# EAGLE design Loginator2368 (EAGLE 6.2)
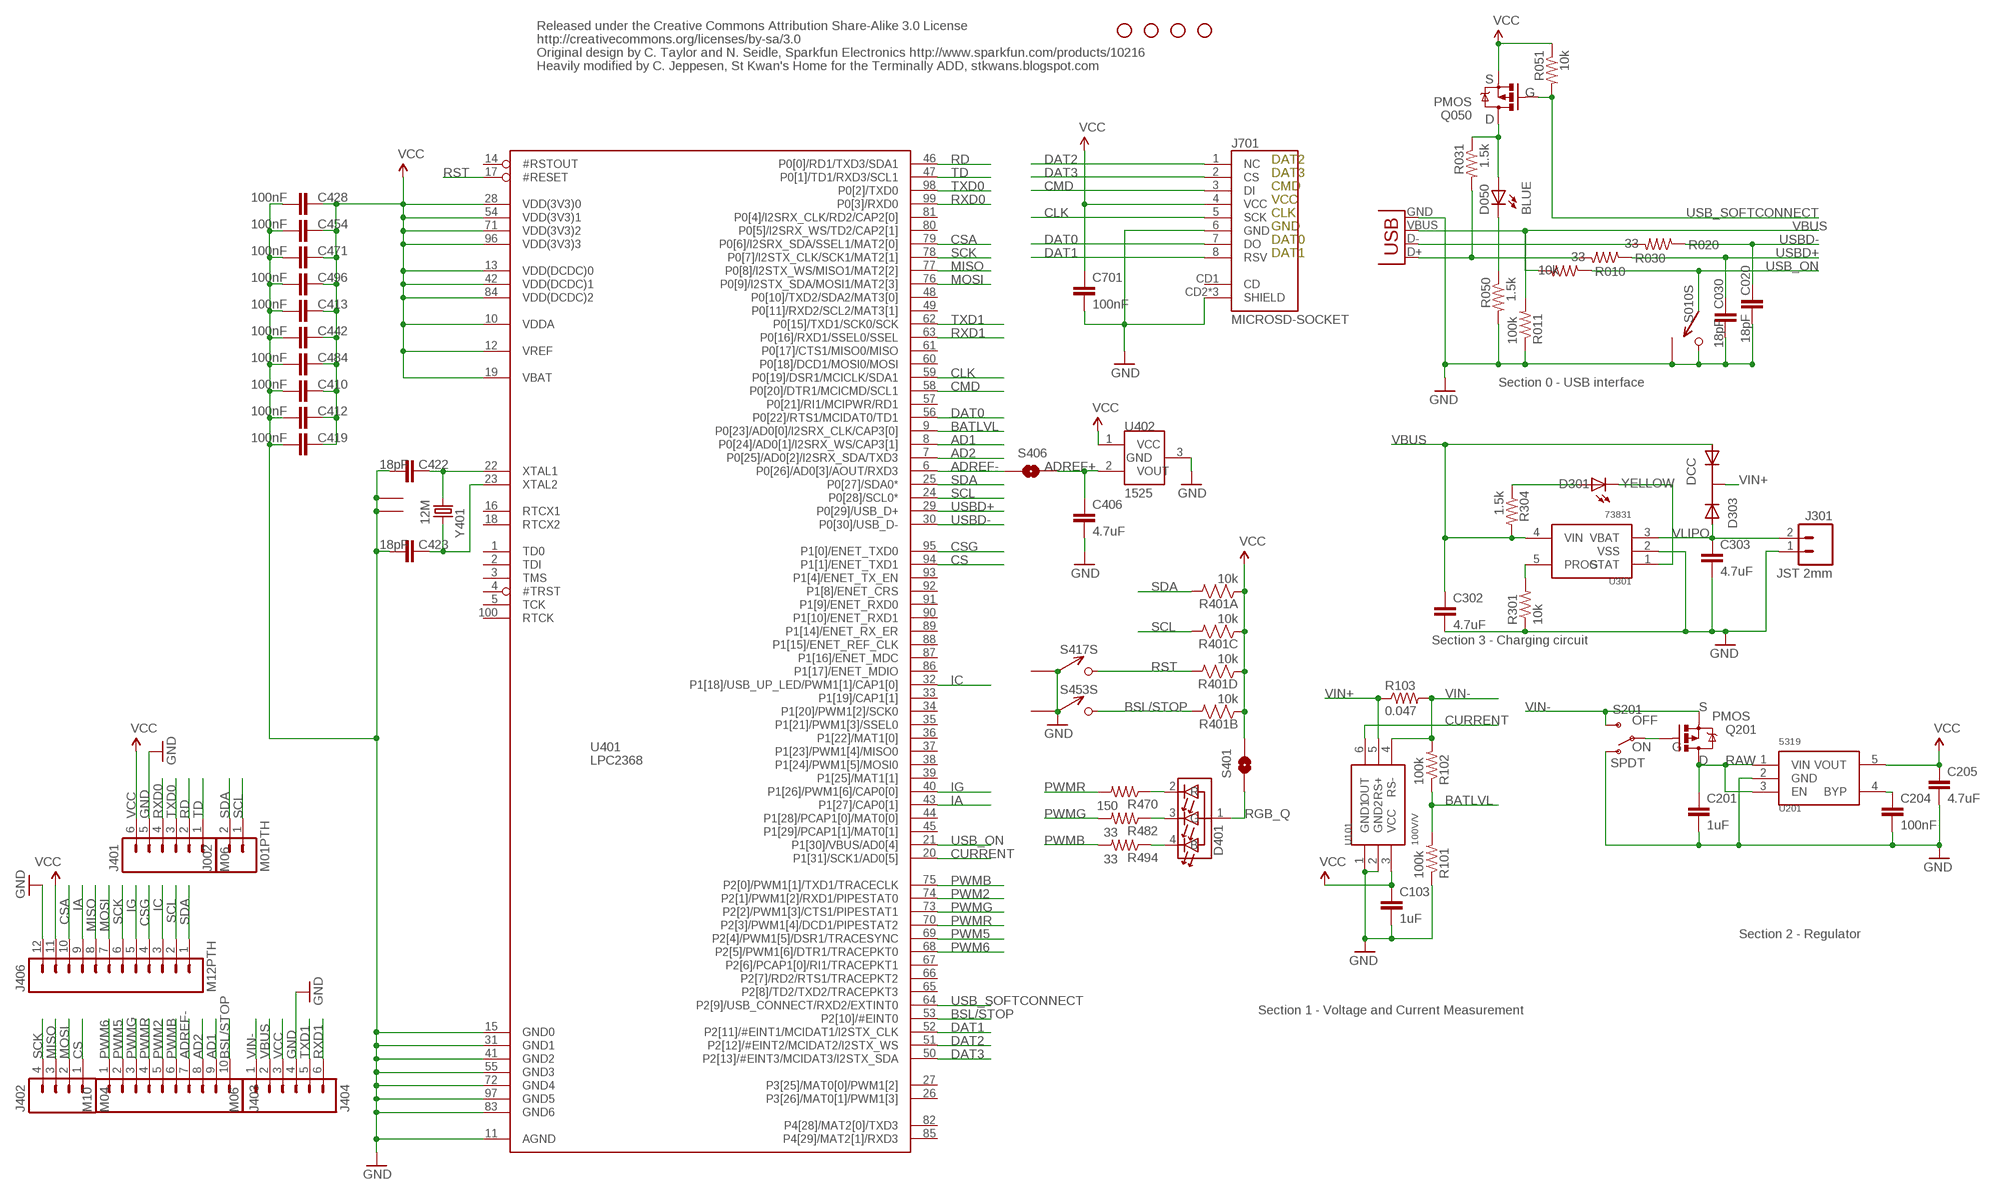
[diagram p0: schematic, sheet 1]

## Parts
C020  18pF  CAP0402-CAP  [0402-CAP]
C030  18pF  CAP0402-CAP  [0402-CAP]
C103  1uF  CAP0402-CAP  [0402-CAP]
C201  1uF  CAP0402-CAP  [0402-CAP]
C204  100nF  CAP0402-CAP  [0402-CAP]
C205  4.7uF  CAP0402-CAP  [0402-CAP]
C302  4.7uF  CAP0402-CAP  [0402-CAP]
C303  4.7uF  CAP0402-CAP  [0402-CAP]
C406  4.7uF  CAP0402-CAP  [0402-CAP]
C410  100nF  CAP0402-CAP  [0402-CAP]
C412  100nF  CAP0402-CAP  [0402-CAP]
C413  100nF  CAP0402-CAP  [0402-CAP]
C419  100nF  CAP0402-CAP  [0402-CAP]
C422  18pF  CAP0402-CAP  [0402-CAP]
C423  18pF  CAP0402-CAP  [0402-CAP]
C428  100nF  CAP0402-CAP  [0402-CAP]
C442  100nF  CAP0402-CAP  [0402-CAP]
C454  100nF  CAP0402-CAP  [0402-CAP]
C471  100nF  CAP0402-CAP  [0402-CAP]
C484  100nF  CAP0402-CAP  [0402-CAP]
C496  100nF  CAP0402-CAP  [0402-CAP]
C701  100nF  CAP0402-CAP  [0402-CAP]
D050  BLUE  LED0603  [LED-0603]
D301  YELLOW  LED0603  [LED-0603]
D303  DCC  PMEG2005CT  [SOT-23-3]
D401  RGB  HSMF-C118  [HSMF-C118]
J001  USBSMD  [USB-MINIB]
J002  M01PTH  M02PTH  [1X02]
J301  JST 2mm  M02-JST-2MM-SMT  [JST-2-SMD]
J401  M06  M06SIP  [1X06]
J402  M04  M04PTH  [1X04]
J403  M10  M10"  [1X10]
J404  M06  M06SIP  [1X06]
J406  M12PTH  [1X12]
J701  MICROSD-SOCKET  [MICROSD-SOCKET-PP]
JP1  STAND-OFF  [STAND-OFF]
JP2  STAND-OFF  [STAND-OFF]
JP3  STAND-OFF  [STAND-OFF]
JP4  STAND-OFF  [STAND-OFF]
Q050  PMOS  MOSFET-PCHANNELSMD  [SOT23-3]
Q201  PMOS  MOSFET-PCHANNELSMD  [SOT23-3]
R010  10k  RESISTOR0402-RES  [0402-RES]
R011  100k  RESISTOR0402-RES  [0402-RES]
R020  33  RESISTOR0402-RES  [0402-RES]
R030  33  RESISTOR0402-RES  [0402-RES]
R031  1.5k  RESISTOR0402-RES  [0402-RES]
R050  1.5k  RESISTOR0402-RES  [0402-RES]
R051  10k  RESISTOR0402-RES  [0402-RES]
R101  100k  RESISTOR0402-RES  [0402-RES]
R102  100k  RESISTOR0402-RES  [0402-RES]
R103  0.047  RESISTOR0402-RES  [0402-RES]
R301  10k  RESISTOR0402-RES  [0402-RES]
R304  1.5k  RESISTOR0402-RES  [0402-RES]
R401  10k  RP404  [CRA04]
R470  150  RESISTOR0402-RES  [0402-RES]
R482  33  RESISTOR0402-RES  [0402-RES]
R494  33  RESISTOR0402-RES  [0402-RES]
S010  SPST  B3U-1100P  [B3U-1100P]
S201  SPDT  SWITCH-SPSTSMD  [AYZ0202]
S401  SOLDERJUMPERNO  [SJ_2S-NO]
S406  SOLDERJUMPERNO  [SJ_2S-NO]
S417  SPST  B3U-1100P  [B3U-1100P]
S453  SPST  B3U-1100P  [B3U-1100P]
U101  100V/V  MAX4173  [SOT-23-6]
U201  5319  MIC5319D5  [SOT-23-5]
U301  73831  MCP73831  [SOT-23-5]
U401  LPC2368  [LQFP100]
U402  1525  MCP1525  [SOT-23-3]
Y401  12M  TSX-3225  [CRYSTAL_SMD]

## Nets
AD1: J403.9 U401.8(P0[24]/AD0[1]/I2SRX_WS/CAP3[1])
AD2: J403.8 U401.7(P0[25]/AD0[2]/I2SRX_SDA/TXD3)
ADREF+: C406.1 S406.1 U402.2(VOUT)
ADREF-: J403.7 S406.2 U401.6(P0[26]/AD0[3]/AOUT/RXD3)
BATLVL: R101.2 R102.1 U401.9(P0[23]/AD0[0]/I2SRX_CLK/CAP3[0])
BSL/STOP: J403.10 R401.7 S453.P$2 U401.53(P2[10]/#EINT0)
CLK: J701.5(SCK) U401.59(P0[19]/DSR1/MCICLK/SDA1)
CMD: J701.3(DI) U401.58(P0[20]/DTR1/MCICMD/SCL1)
CONN_D+: J001.D+ R030.2 R031.2
CONN_D-: J001.D- R020.2
CS: J402.1 U401.94(P1[1]/ENET_TXD1)
CSA: J406.10 U401.79(P0[6]/I2SRX_SDA/SSEL1/MAT2[0])
CSG: J406.4 U401.95(P1[0]/ENET_TXD0)
CURRENT: U101.6(OUT) U401.20(P1[31]/SCK1/AD0[5])
DAT0: J701.7(DO) U401.56(P0[22]/RTS1/MCIDAT0/TD1)
DAT1: J701.8(RSV) U401.52(P2[11]/#EINT1/MCIDAT1/I2STX_CLK)
DAT2: J701.1(NC) U401.51(P2[12]/#EINT2/MCIDAT2/I2STX_WS)
DAT3: J701.2(CS) U401.50(P2[13]/#EINT3/MCIDAT3/I2STX_SDA)
DB: D401.4(B) R494.1
DG: D401.3(G) R482.1
DR: D401.2(R) R470.1
GND: C020.2 C030.2 C103.2 C201.2 C204.2 C205.2 C302.2 C303.2 C406.2 C410.2 C412.2 C413.2 C419.2 C422.1 C423.1 C428.2 C442.2 C454.2 C471.2 C484.2 C496.2 C701.2 J001.GND J301.1 J401.5 J404.4 J406.12 J701.6(GND) J701.CD2(SHIELD) J701.GND1(SHIELD) J701.GND3(SHIELD) R011.1 R050.2 R101.1 R301.1 S010.P$2 S010.P$3 S201.1(O) S417.P$1 S417.P$3 S453.P$1 S453.P$3 U101.1(GND1) U101.2(GND2) U201.2(GND) U301.2(VSS) U401.11(AGND) U401.15(GND0) U401.31(GND1) U401.41(GND2) U401.55(GND3) U401.72(GND4) U401.83(GND6) U401.97(GND5) U402.3(GND) Y401.2 Y401.4
IA: J406.9 U401.43(P1[27]/CAP0[1])
IC: J406.3 U401.32(P1[18]/USB_UP_LED/PWM1[1]/CAP1[0])
IG: J406.5 U401.40(P1[26]/PWM1[6]/CAP0[0])
MISO: J402.3 J406.8 U401.77(P0[8]/I2STX_WS/MISO1/MAT2[2])
MOSI: J402.2 J406.7 U401.76(P0[9]/I2STX_SDA/MOSI1/MAT2[3])
N$1: D301.A R304.1
N$2: R301.2 U301.5(PROG)
N$4: D301.C U301.1(STAT)
N$6: D050.A Q050.3(D) R031.1
N$7: D050.C R050.1
N$10: Q201.1(G) S201.2(P)
N$17: C204.1 U201.4(BYP)
PWM2: J403.5 U401.74(P2[1]/PWM1[2]/RXD1/PIPESTAT0)
PWM5: J403.2 U401.69(P2[4]/PWM1[5]/DSR1/TRACESYNC)
PWM6: J403.1 U401.68(P2[5]/PWM1[6]/DTR1/TRACEPKT0)
PWMB: J403.6 R494.2 U401.75(P2[0]/PWM1[1]/TXD1/TRACECLK)
PWMG: J403.3 R482.2 U401.73(P2[2]/PWM1[3]/CTS1/PIPESTAT1)
PWMR: J403.4 R470.2 U401.70(P2[3]/PWM1[4]/DCD1/PIPESTAT2)
RAW: C201.1 Q201.3(D) U201.1(VIN) U201.3(EN)
RD: J401.2 U401.46(P0[0]/RD1/TXD3/SDA1)
RGB_Q: D401.1(A) S401.1
RST: R401.5 S417.P$2 U401.17(#RESET)
RXD0: J401.4 U401.99(P0[3]/RXD0)
RXD1: J404.6 U401.63(P0[16]/RXD1/SSEL0/SSEL)
SCK: J402.4 J406.6 U401.78(P0[7]/I2STX_CLK/SCK1/MAT2[1])
SCL: J002.1 J406.2 R401.6 U401.24(P0[28]/SCL0*)
SDA: J002.2 J406.1 R401.8 U401.25(P0[27]/SDA0*)
TD: J401.1 U401.47(P0[1]/TD1/RXD3/SCL1)
TXD0: J401.3 U401.98(P0[2]/TXD0)
TXD1: J404.5 U401.62(P0[15]/TXD1/SCK0/SCK)
USB_ON: R010.1 S010.P$1 U401.21(P1[30]/VBUS/AD0[4])
USB_SOFTCONNECT: Q050.1(G) R051.2 U401.64(P2[9]/USB_CONNECT/RXD2/EXTINT0)
USBD+: C030.1 R030.1 U401.29(P0[29]/USB_D+)
USBD-: C020.1 R020.1 U401.30(P0[30]/USB_D-)
VBUS [power]: C302.1 D303.1(A1) J001.VBUS J404.2 R010.2 R011.2 R304.2 U301.4(VIN)
VCC: C103.1 C205.1 C410.1 C412.1 C413.1 C419.1 C428.1 C442.1 C454.1 C471.1 C484.1 C496.1 C701.1 J401.6 J404.3 J406.11 J701.4(VCC) Q050.2(S) R051.1 R401.1 R401.2 R401.3 R401.4 S401.2 U101.3(VCC) U201.5(VOUT) U401.10(VDDA) U401.12(VREF) U401.13(VDD(DCDC)0) U401.19(VBAT) U401.28(VDD(3V3)0) U401.42(VDD(DCDC)1) U401.54(VDD(3V3)1) U401.71(VDD(3V3)2) U401.84(VDD(DCDC)2) U401.96(VDD(3V3)3) U402.1(VCC)
VIN+: D303.3(K) R103.1 U101.5(RS+)
VIN-: J404.1 Q201.2(S) R102.2 R103.2 S201.3(S) U101.4(RS-)
VLIPO [power]: C303.1 D303.2(A2) J301.2 U301.3(VBAT)
XTAL1: C422.2 U401.22(XTAL1) Y401.3
XTAL2: C423.2 U401.23(XTAL2) Y401.1
Unconnected: J701.CD1(CD) U401.1(TD0) U401.2(TDI) U401.3(TMS) U401.4(#TRST) U401.5(TCK) U401.14(#RSTOUT) U401.16(RTCX1) U401.18(RTCX2) U401.26(P3[26]/MAT0[1]/PWM1[3]) U401.27(P3[25]/MAT0[0]/PWM1[2]) U401.33(P1[19]/CAP1[1]) U401.34(P1[20]/PWM1[2]/SCK0) U401.35(P1[21]/PWM1[3]/SSEL0) U401.36(P1[22]/MAT1[0]) U401.37(P1[23]/PWM1[4]/MISO0) U401.38(P1[24]/PWM1[5]/MOSI0) U401.39(P1[25]/MAT1[1]) U401.44(P1[28]/PCAP1[0]/MAT0[0]) U401.45(P1[29]/PCAP1[1]/MAT0[1]) U401.48(P0[10]/TXD2/SDA2/MAT3[0]) U401.49(P0[11]/RXD2/SCL2/MAT3[1]) U401.57(P0[21]/RI1/MCIPWR/RD1) U401.60(P0[18]/DCD1/MOSI0/MOSI) U401.61(P0[17]/CTS1/MISO0/MISO) U401.65(P2[8]/TD2/TXD2/TRACEPKT3) U401.66(P2[7]/RD2/RTS1/TRACEPKT2) U401.67(P2[6]/PCAP1[0]/RI1/TRACEPKT1) U401.80(P0[5]/I2SRX_WS/TD2/CAP2[1]) U401.81(P0[4]/I2SRX_CLK/RD2/CAP2[0]) U401.82(P4[28]/MAT2[0]/TXD3) U401.85(P4[29]/MAT2[1]/RXD3) U401.86(P1[17]/ENET_MDIO) U401.87(P1[16]/ENET_MDC) U401.88(P1[15]/ENET_REF_CLK) U401.89(P1[14]/ENET_RX_ER) U401.90(P1[10]/ENET_RXD1) U401.91(P1[9]/ENET_RXD0) U401.92(P1[8]/ENET_CRS) U401.93(P1[4]/ENET_TX_EN) U401.100(RTCK)

## Notes on the sheet
- Released under the Creative Commons Attribution Share-Alike 3.0 License
- http://creativecommons.org/licenses/by-sa/3.0
- Original design by C. Taylor and N. Seidle, Sparkfun Electronics http://www.sparkfun.com/products/10216
- Heavily modified by C. Jeppesen, St Kwan's Home for the Terminally ADD, stkwans.blogspot.com
- S
- G
- D
- DAT2
- DAT3
- CMD
- VCC
- CLK
- GND
- DAT0
- DAT1
- Section 0 - USB interface
- Section 3 - Charging circuit
- S
- OFF
- ON | G
- D
- Section 2 - Regulator
- Section 1 - Voltage and Current Measurement

## Library data of the parts
C020 C030 C103 C201 C204 C205 C302 C303 C406 C410 C412 C413 C419 C422 C423 C428 C442 C454 C471 C484 C496 C701 = SparkFun:CAP: Capacitor Standard 0603 ceramic capacitor, and 0.1" leaded capacitor.
D050 D301 = SparkFun:LED: LEDs Standard schematic elements and footprints for 5mm, 3mm, 1206, and 0603 sized LEDs. 5mm - Spark Fun Electronics SKU : COM-00529 (and others)
D303 = KwanSystems:PMEG2005CT
D401 = KwanSystems:HSMF-C118
J001 = SparkFun:USB: USB Connectors USB-B-PTH is fully proven SKU : PRT-00139 USB-miniB is fully proven SKU : PRT-00587 USB-A-PCB is untested. USB-A-H is throughly reviewed, but untested. Spark Fun Electronics SKU : PRT-00437 USB-B-SMT is throughly reviewed, but untested. Needs silkscreen touching up. USB-A-S has not been used/tested USB-MB-H has not been used/tested
J002 J301 = SparkFun:M02: Header 2 Standard 2-pin 0.1" header. Use with straight break away headers (SKU : PRT-00116), right angle break away headers (PRT-00553), swiss pins (PRT-00743), machine pins (PRT-00117), and female headers (PRT-00115). Molex polarized connector foot print use with SKU : PRT-08233 with associated crimp pins and housings.
J401 J404 = SparkFun:M06: Header 6 Standard 6-pin 0.1" header. Use with straight break away headers (SKU : PRT-00116), right angle break away headers (PRT-00553), swiss pins (PRT-00743), machine pins (PRT-00117), and female headers (PRT-00115). Molex polarized connector foot print use with SKU : PRT-08094 with associated crimp pins and housings. NOTES ON THE VARIANTS LOCK and LOCK_LONGPADS... This footprint was designed to help hold the alignment of a through-hole component (i.e. 6-pin header) while soldering it into place. You may notice that each hole has been shifted either up or down by 0.005 of an inch from it's more standard position (which is a perfectly straight line). This slight alteration caused the pins (the squares in the middle) to touch the edges of the holes. Because they are alternating, it causes a "brace" to hold the component in place. 0.005 has proven to be the perfect amount of "off-center" position when using our standard breakaway headers. Although looks a little odd when you look at the bare footprint, once you have a header in there, the alteration is very hard to notice. Also, if you push a header all the way into place, it is covered up entirely on the bottom side. This idea of altering the position of holes to aid alignment will be further integrated into the Sparkfun Library for other footprints. It can help hold any component with 3 or more connection pins.
J402 = SparkFun:M04: Header 4 Standard 4-pin 0.1" header. Use with straight break away headers (SKU : PRT-00116), right angle break away headers (PRT-00553), swiss pins (PRT-00743), machine pins (PRT-00117), and female headers (PRT-00115). Molex polarized connector foot print use with SKU : PRT-08231 with associated crimp pins and housings. 1MM SMD Version SKU: PRT-10208
J403 = SparkFun:M10: Header 10 Standard 10-pin 0.1" header. Use with straight break away headers (SKU : PRT-00116), right angle break away headers (PRT-00553), swiss pins (PRT-00743), machine pins (PRT-00117), and female headers (PRT-00115).
J406 = SparkFun:M12: Header 12 Standard 12-pin 0.1" header. Use with straight break away headers (SKU : PRT-00116), right angle break away headers (PRT-00553), swiss pins (PRT-00743), machine pins (PRT-00117), and female headers (PRT-00115).
J701 = KwanSystems:MICROSD-SOCKET: microSD Socket Push-push type uSD socket. Digikey 101-00660-68-6-1-ND. tDoc lines correctly indicate media card edge positions when inserting (unlocked, locked, depressed).
JP1-JP4 = SparkFun:STAND-OFF: Stand Off This is the mechanical footprint for a #4 phillips button head screw. Use the keepout ring to avoid running the screw head into surrounding components. SKU : PRT-00447
Q050 Q201 = SparkFun:MOSFET-PCHANNEL
R010 R011 R020 R030 R031 R050 R051 R101-R103 R301 R304 R470 R482 R494 = SparkFun:RESISTOR: Resistor Basic schematic elements and footprints for 0603, 1206, and PTH resistors.
R401 = KwanSystems:RP4
S010 S417 S453 = KwanSystems:B3U-1100P
S201 = SparkFun:SWITCH-SPST: SPST Switch Simple slide switch. Spark Fun Electronics SKU : COM-00102
S401 S406 = SparkFun:SOLDERJUMPER: Solder Jumper Standard SMD solder jumper. Used to automate production. Two varients : Normally Open and Normally Closed are the same, but have different paste layers. NC will have a large amount of paste and should jumper during reflow.
U101 = KwanSystems:MAX4173
U201 = KwanSystems:MIC5319
U301 = KwanSystems:MCP73831
U401 = KwanSystems:LPC2368
U402 = KwanSystems:MCP1525
Y401 = KwanSystems:TSX-3225

## Net classes
0 default: width 0.152 mm, drill 0.33 mm, clearance 0.152 mm
1 power: width 0.152 mm, drill 0.33 mm, clearance 0.152 mm to class 0, clearance 0.152 mm
2 hv: width 0.152 mm, drill 0.33 mm, clearance 0.152 mm to class 0, clearance 0.152 mm to class 1, clearance 0.152 mm

## Board
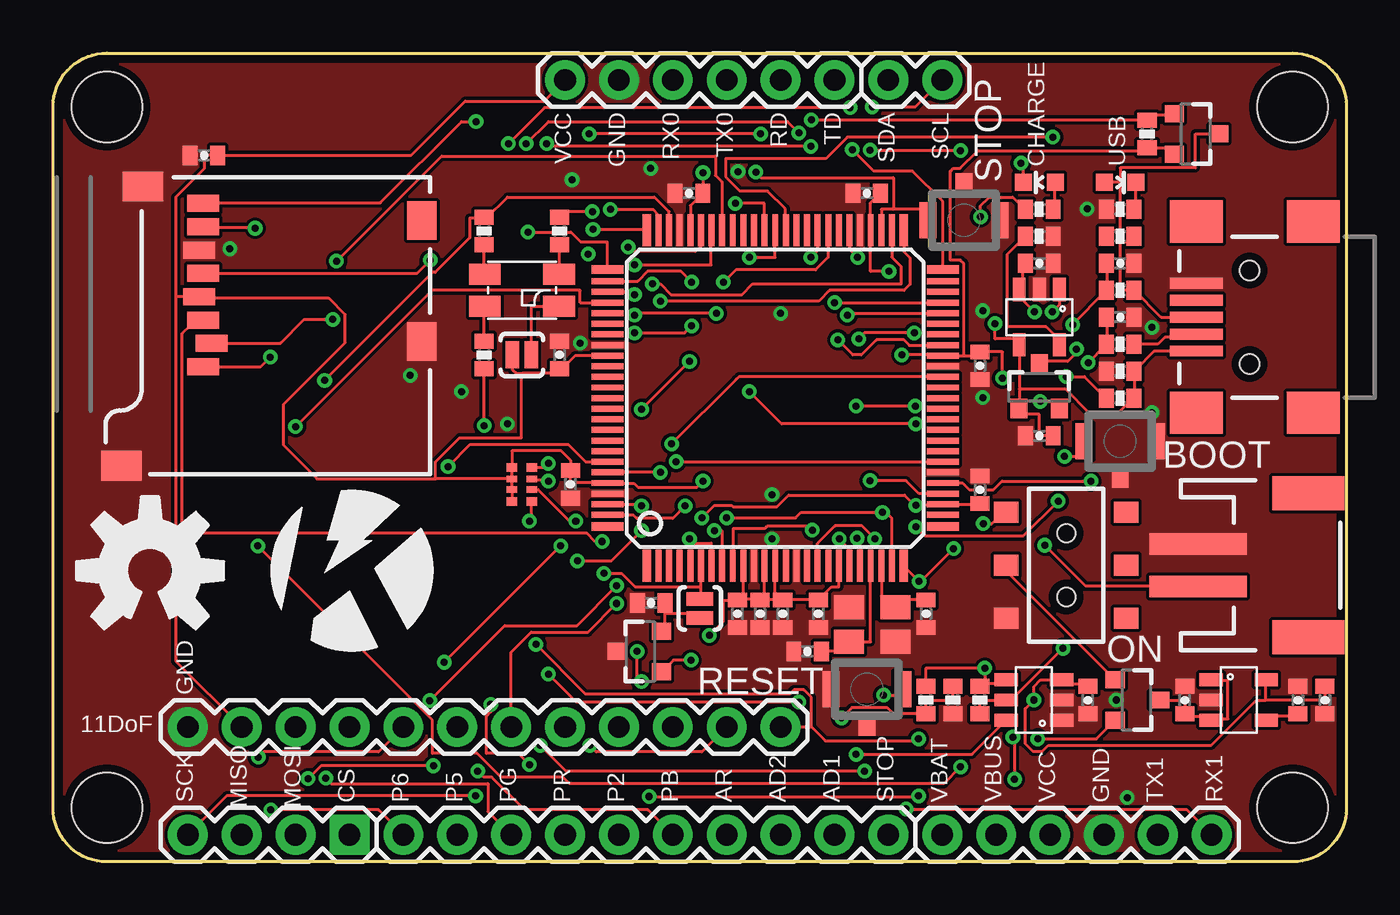
[diagram p1: board, top side]
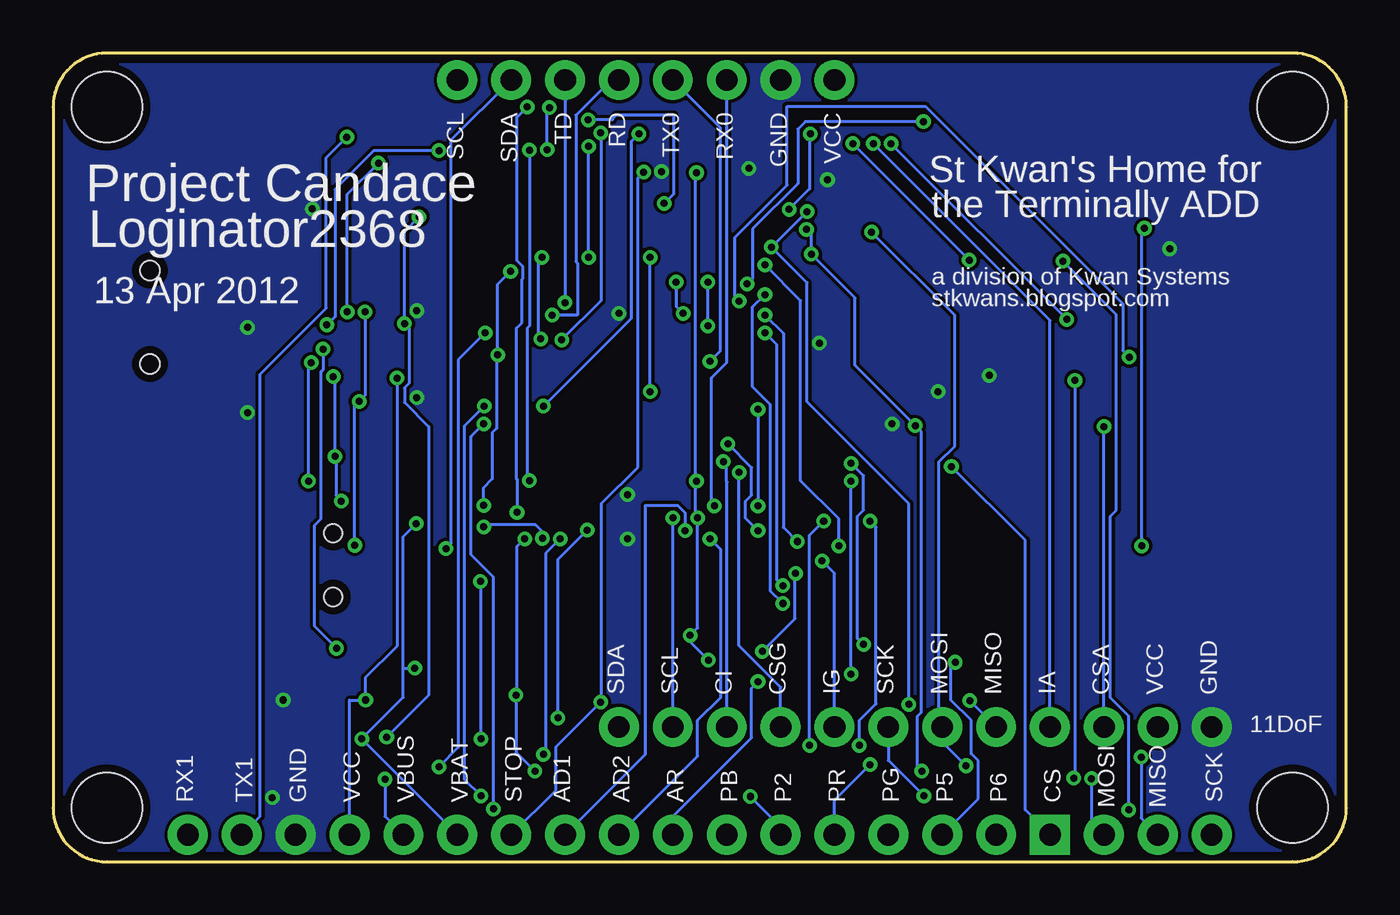
[diagram p2: board, bottom side, seen from below]

Size 60.96 x 38.1 mm. Coordinates in mm from the lower left corner, seen from the top.
Outline: 2.54,38.1 58.42,38.1 arc-90 60.96,35.56 60.96,2.54 arc-90 58.42,0 2.54,0 arc-90 0,2.54 0,35.56 arc-90 2.54,38.1
Copper layers (1*16): Top 0.0356mm / dielectric 1.5011mm / Bottom 0.0356mm
Design rules: minimum track width 6mil, minimum drill 13mil, track to track 6mil, track to pad 6mil, pad to pad 6mil, via to via 6mil, smd to smd 6mil, copper to edge 15mil, drill to drill 6mil, minimum pad ring 7mil, minimum via ring 7mil, stop-mask expansion 4mil, vias tented up to drill 14mil, thermal gap 10mil
vRestrict: area 5.8,2.3 to 6.6,5.1; area 7.1,3.8 to 10.4,4.6; area 9.4,2.8 to 13,3.6; area 13.2,2.8 to 14.5,4.8; area 15.7,2.8 to 17,4.8; area 18.3,2.8 to 19.6,4.8; area 20.8,2.8 to 22.1,4.8; area 23.4,2.8 to 24.6,4.8; area 25.9,2.8 to 27.2,4.8; area 28.4,2.8 to 29.7,4.8; area 31,2.8 to 32.3,4.8; area 33.5,2.8 to 34.8,4.8; 44 more areas

### Footprints (pad centres in the part's own frame; a part is rotated, then mirrored left to right if it is on the bottom)
0402-CAP = smd 0.7 x 0.9: 1 -0.65,0; 2 0.65,0
LED-0603 = smd 0.8 x 0.8: A 0,-0.75; C 0,0.75
SOT-23-3 = smd 0.9 x 0.8: 1 -1,0.95; 2 -1,-0.95; 3 1.1,0
HSMF-C118 = smd 1.5 x 1: 1 1.75,-0.75; 2 1.75,0.75; 3 -1.75,0.75; 4 -1.75,-0.75
USB-MINIB = smd 2.5 x 0.5: D+ 2.5,0; D- 2.5,0.8; GND 2.5,-1.6; ID 2.5,-0.8; VBUS 2.5,1.6 | smd 2.5 x 2: MTN1 -3,4.5; MTN2 2.5,4.5; MTN3 -3,-4.5; MTN4 2.5,-4.5 | hole 0.9: 0,2.2; 0,-2.2
1X02 = drill 1.016 pad 1.88: 1 0,0; 2 2.54,0
JST-2-SMD = smd 1 x 4.6: 1 -1,-3.7; 2 1,-3.7 | smd 1.6 x 3.4: NC1 -3.4,1.5; NC2 3.4,1.5
1X06 = drill 1.016 pad 1.88: 1 0,0; 2 2.54,0; 3 5.08,0; 4 7.62,0; 5 10.16,0; 6 12.7,0
1X04 = drill 1.016 pad 1.88 square: 1 0,0 | drill 1.016 pad 1.88: 2 2.54,0; 3 5.08,0; 4 7.62,0
1X10 = drill 1.016 pad 1.88: 1 0,0; 2 2.54,0; 3 5.08,0; 4 7.62,0; 5 10.16,0; 6 12.7,0; 7 15.24,0; 8 17.78,0; 9 20.32,0; 10 22.86,0
1X12 = drill 1.016 pad 1.88: 1 0,0; 2 2.54,0; 3 5.08,0; 4 7.62,0; 5 10.16,0; 6 12.7,0; 7 15.24,0; 8 17.78,0; 9 20.32,0; 10 22.86,0; 11 25.4,0; 12 27.94,0
MICROSD-SOCKET-PP = smd 0.8 x 1.5: 1 -8.94,10.7; 2 -7.84,10.3; 3 -6.74,10.7; 4 -5.64,10.9; 5 -4.54,10.7; 6 -3.44,10.9; 7 -2.34,10.7; 8 -1.24,10.7 | smd 1.8 x 1.4: CD1 -2.05,0.4; CD2 -7.75,0.4 | smd 1.4 x 1.9: GND1 -13.6,14.55; GND3 -0.45,13.55
STAND-OFF = hole 3.302: 0,0
SOT23-3 = smd 0.8 x 0.9: 1 -0.95,-1; 2 0.95,-1; 3 0,1.1
0402-RES = smd 0.7 x 0.9: 1 -0.65,0; 2 0.65,0
CRA04 = smd 0.4 x 0.5: 1 -0.8,-0.475; 4 0.8,-0.475; 5 0.8,0.475; 8 -0.8,0.475 | smd 0.3 x 0.5: 2 -0.25,-0.475; 3 0.25,-0.475; 6 0.25,0.475; 7 -0.25,0.475
B3U-1100P = smd 0.8 x 1.7: P$1 -1.7,0; P$2 1.7,0 | smd 0.8 x 1.1: P$3 0,-1.65
AYZ0202 = smd 1 x 1.15: 1 -2.5,2.825; 2 0,2.825; 3 2.5,2.825; 4 -2.5,-2.825; 5 0,-2.825; 6 2.5,-2.825 | hole 0.85: 1.5,0; -1.5,0
SJ_2S-NO = smd 0.635 x 1.27: 1 -0.45,0; 2 0.45,0
SOT-23-6 = smd 0.6 x 1.1: 1 -0.95,-1.3; 2 0,-1.3; 3 0.95,-1.3; 4 0.95,1.3; 5 0,1.3; 6 -0.95,1.3
SOT-23-5 = smd 0.6 x 1.1: 1 -0.95,-1.3; 2 0,-1.3; 3 0.95,-1.3; 4 0.95,1.3; 5 -0.95,1.3
LQFP100 = smd 1.5 x 0.4: 1 -7.9,6.06; 25 -7.9,-6.06; 51 7.9,-6.06; 75 7.9,6.06 | smd 1.5 x 0.28: 2 -7.9,5.5; 3 -7.9,5; 4 -7.9,4.5; 5 -7.9,4; 6 -7.9,3.5; 7 -7.9,3; 8 -7.9,2.5; 9 -7.9,2; 10 -7.9,1.5; 11 -7.9,1; 12 -7.9,0.5; 13 -7.9,0; 14 -7.9,-0.5; 15 -7.9,-1; 16 -7.9,-1.5; 17 -7.9,-2; 18 -7.9,-2.5; 19 -7.9,-3; 20 -7.9,-3.5; 21 -7.9,-4; 22 -7.9,-4.5; 23 -7.9,-5; 24 -7.9,-5.5; 52 7.9,-5.5; 53 7.9,-5; 54 7.9,-4.5; 55 7.9,-4; 56 7.9,-3.5; 57 7.9,-3; 58 7.9,-2.5; 59 7.9,-2; 60 7.9,-1.5; 61 7.9,-1; 62 7.9,-0.5; 63 7.9,0; 64 7.9,0.5; 65 7.9,1; 66 7.9,1.5; 67 7.9,2; 68 7.9,2.5; 69 7.9,3; 70 7.9,3.5; 71 7.9,4; 72 7.9,4.5; 73 7.9,5; 74 7.9,5.5 | smd 0.4 x 1.5: 26 -6.06,-7.9; 50 6.06,-7.9; 76 6.06,7.9; 100 -6.06,7.9 | smd 0.28 x 1.5: 27 -5.5,-7.9; 28 -5,-7.9; 29 -4.5,-7.9; 30 -4,-7.9; 31 -3.5,-7.9; 32 -3,-7.9; 33 -2.5,-7.9; 34 -2,-7.9; 35 -1.5,-7.9; 36 -1,-7.9; 37 -0.5,-7.9; 38 0,-7.9; 39 0.5,-7.9; 40 1,-7.9; 41 1.5,-7.9; 42 2,-7.9; 43 2.5,-7.9; 44 3,-7.9; 45 3.5,-7.9; 46 4,-7.9; 47 4.5,-7.9; 48 5,-7.9; 49 5.5,-7.9; 77 5.5,7.9; 78 5,7.9; 79 4.5,7.9; 80 4,7.9; 81 3.5,7.9; 82 3,7.9; 83 2.5,7.9; 84 2,7.9; 85 1.5,7.9; 86 1,7.9; 87 0.5,7.9; 88 0,7.9; 89 -0.5,7.9; 90 -1,7.9; 91 -1.5,7.9; 92 -2,7.9; 93 -2.5,7.9; 94 -3,7.9; 95 -3.5,7.9; 96 -4,7.9; 97 -4.5,7.9; 98 -5,7.9; 99 -5.5,7.9
CRYSTAL_SMD = smd 1.4 x 1.15: 1 -1.092,-0.813; 2 1.092,-0.813; 3 1.092,0.813; 4 -1.092,0.813

### Placement (x,y rotation side)
C020  50.29,25.65 0 top
C030  50.29,28.19 0 top
C103  48.77,7.62 270 top
C201  53.34,7.62 90 top
C204  58.67,7.62 90 top
C205  59.94,7.62 270 top
C302  46.48,20.07 180 top
C303  46.48,28.19 0 top
C406  28.19,12.19 180 top
C410  32.26,11.68 270 top
C412  33.32,11.68 270 top
C413  34.39,11.68 270 top
C419  36.07,11.68 270 top
C422  35.56,9.91 0 top
C423  41.15,11.68 90 top
C428  43.69,17.53 90 top
C442  43.69,23.37 270 top
C454  38.35,31.5 180 top
C471  29.97,31.5 180 top
C484  23.88,23.88 90 top
C496  24.38,17.78 270 top
C701  7.11,33.27 180 top
D050  50.29,32 270 top
D301  46.48,32 90 top
D303  46.48,22.35 90 top
D401  22.1,26.92 0 top
J001  56.39,25.65 180 top
J002  41.91,36.83 180 top
J301  57.66,13.97 270 top
J401  36.83,36.83 180 top
J402  13.97,1.27 180 top
J403  16.51,1.27 0 top
J404  41.91,1.27 0 top
J406  34.29,6.35 180 top
J701  17.78,32.26 90 top
JP1  2.54,2.54 0 top
JP2  58.42,2.54 0 top
JP3  2.54,35.56 0 top
JP4  58.42,35.56 0 top
Q050  53.85,34.29 270 top
Q201  51.05,7.62 270 top
R010  50.29,21.84 0 top
R011  50.29,23.11 0 top
R020  50.29,24.38 0 top
R030  50.29,26.92 0 top
R031  50.29,29.46 0 top
R050  50.29,30.73 180 top
R051  51.56,34.29 90 top
R101  42.42,7.62 90 top
R102  41.15,7.62 90 top
R103  43.69,7.62 90 top
R301  46.48,29.46 180 top
R304  46.48,30.73 180 top
R401  22.1,17.78 270 top
R470  23.88,29.72 90 top
R482  20.32,29.72 90 top
R494  20.32,23.88 270 top
S010  50.29,19.81 0 top
S201  47.75,13.97 90 top
S401  22.1,23.88 180 top
S406  30.48,11.94 90 top
S417  38.35,8.13 0 top
S453  42.93,30.23 180 top
U101  46.23,7.62 90 top
U201  55.88,7.62 270 top
U301  46.48,25.65 180 top
U401  34.04,21.84 90 top
U402  27.69,9.91 180 top
U$1  [KWAN_CIRCLE]  14.1,13.72 0 top
U$2  [OSHW-LOGO-L]  4.57,13.72 0 top
Y401  38.61,11.18 180 top

### Tracks (layer width: path | path; a pad name or v marks a point on that pad's centre or on a via)
AD1  (via drill 0.33)
  Top 0.152: v31.17,15.6 31.52,15.6 31.52,13.95 U401.8
  Bottom 0.152: v31.17,15.6 31.17,16.43 31.52,16.79 33.05,16.79 33.05,5.05 J403.9
AD2  (via drill 0.33)
  Top 0.152: v30,15.21 30.2,15.01 31.01,15.01 31.01,13.95 U401.7
  Bottom 0.152: v30,15.21 29.49,14.71 29.49,7.75 30.58,6.66 30.58,4.98 J403.8
ADREF+
  Top 0.152: U402.2 28.84,11.01 28.84,11.68 | 28.84,11.68 C406.1 | S406.1 30.28,11.68 28.84,11.68
ADREF-  (via drill 0.33)
  Top 0.152: S406.2 30.54,12.44 30.54,12.95 | 30.54,12.95 U401.6 | 30.54,12.95 27.43,12.95 26.8,13.59 v25.96,13.59 | v27.53,9.91 27.53,8.48 v27.74,8.48
  Bottom 0.152: v25.96,13.59 25.98,13.56 25.98,11.46 v27.53,9.91 | v27.74,8.48 28.04,8.18 28.04,5.84 31.75,2.13 J403.7
BATLVL  (via drill 0.33)
  Top 0.152: R101.2 42.42,7.62 41.15,7.62 R102.1 39.61,6.97 39.32,7.26 37.64,7.26 v37.16,6.78 | v35.79,15.62 35.61,15.8 33.66,15.8 33.55,15.7 32.05,15.7 32.05,13.95 U401.9
  Bottom 0.152: v35.79,15.62 37.16,14.25 v37.16,6.78
BSL/STOP  (via drill 0.33)
  Top 0.152: 39.6,30.73 41.23,30.73 S453.P$2 | 39.6,30.73 39.04,30.73 39.04,29.77 U401.53 | v23.34,8.84 24.66,7.52 v35.15,7.52 | R401.7 22.58,18.01 23.27,18.01 v23.34,17.93 | 39.6,30.73 39.6,32.23 33.38,32.23 v33.12,32.49
  Bottom 0.152: v23.34,8.84 v23.34,17.93 | J403.10 37.26,3.38 37.26,5.41 v35.15,7.52 35.1,7.57 35.1,16.89 33.4,18.59 33.4,32.21 v33.12,32.49
CLK  (via drill 0.33)
  Top 0.152: v17.78,28.35 17.14,27.71 J701.5 | v23.27,33.83 23.39,33.71 v35.71,33.71 | v35.71,28.47 36.02,28.78 36.02,29.74 U401.59
  Bottom 0.152: v23.27,33.83 v17.78,28.35 | v35.71,28.47 v35.71,33.71
CMD  (via drill 0.33)
  Top 0.152: v25.88,15.09 25.55,15.09 25.17,15.47 6.1,15.47 6.1,24.89 6.48,25.27 6.83,25.27 J701.3 7.06,25.5 | v27.41,25.76 27.48,25.83 v31.27,25.83 | v31.6,27.3 32.18,27.89 35.94,27.89 36.52,28.47 36.52,29.74 U401.58
  Bottom 0.152: v25.88,15.09 26.54,15.75 26.54,24.89 v27.41,25.76 | v31.27,25.83 31.6,26.16 v31.6,27.3
CONN_D+
  Top 0.152: 53.87,25.65 J001.D+ 52.22,25.65 50.95,26.92 R030.2 50.29,26.92 50.29,29.21 50.93,29.21 50.93,29.46 R031.2 50.95,29.46
CONN_D-
  Top 0.152: 50.95,24.38 R020.2 52.07,24.38 52.4,24.71 53.75,24.71 53.87,24.84 J001.D-
CS  (via drill 0.33)
  Top 0.152: v18.62,18.62 19.66,19.66 24.28,19.66 25.1,18.84 U401.94 26.11,18.85
  Bottom 0.152: v18.62,18.62 15.14,15.14 15.14,2.44 J402.1
CSA  (via drill 0.33)
  Top 0.152: v11.43,20.5 17.86,26.92 24.84,26.92 24.84,26.34 U401.79 26.11,26.34
  Bottom 0.152: J406.10 v11.43,20.5
CSG  (via drill 0.33)
  Top 0.152: v28.63,18.34 U401.95
  Bottom 0.152: v28.63,18.34 28.63,10.19 26.67,8.23 J406.4
CURRENT  (via drill 0.33)
  Top 0.152: v37.85,5.05 43.31,5.05 44.91,6.66 U101.6 | v37.06,15.21 37.52,14.76 37.52,13.95 U401.20
  Bottom 0.152: v37.85,5.05 37.74,5.16 37.74,14.53 v37.06,15.21
DAT0  (via drill 0.33)
  Top 0.152: v9.65,14.88 17.88,6.66 17.88,5.11 19.99,5.11 21.11,3.99 24.03,3.99 24.33,3.68 41.99,3.68 v42.77,4.47 | v37.92,28.47 37.54,28.85 U401.56 | J701.7 7.09,29.9 9.47,29.9 v9.53,29.84 | v40.59,24.92 38.25,24.92 v37.97,24.64
  Bottom 0.152: v9.65,14.88 9.65,29.72 v9.53,29.84 | v42.77,4.47 41.86,5.38 41.86,23.65 v40.59,24.92 | 37.97,28.42 v37.92,28.47 38.1,28.45 38.1,24.64 v37.97,24.64
DAT1  (via drill 0.33)
  Top 0.152: v28.25,27.23 28.63,27.23 29.13,26.72 32.46,26.72 32.97,27.23 39.98,27.23 39.98,28.04 39.54,28.48 U401.52 | J701.8 7.09,31.04 15.42,31.04 19.25,34.87 v19.94,34.87
  Bottom 0.152: v28.25,27.23 27.99,27.48 27.99,29.82 25.86,31.95 25.86,34.52 25.5,34.87 v19.94,34.87
DAT2  (via drill 0.33)
  Top 0.152: v28.63,26.42 36.09,26.42 36.6,26.92 40.11,26.92 40.39,27.2 40.39,28.45 40.11,28.73 U401.51 | 7.09,23.34 J701.1 9.78,23.32 v10.24,23.77
  Bottom 0.152: v10.24,23.77 10.54,24.08 10.54,26.29 19.84,35.59 26.36,35.59 26.36,31.88 28.83,29.41 28.83,26.62 v28.63,26.42
DAT3  (via drill 0.33)
  Top 0.152: v21.46,33.83 23.16,35.53 v37.57,35.53 | v37.67,33.55 38.68,32.54 40.51,32.54 41.94,31.11 41.94,27.91 U401.50 | J701.2 7.49,24.43 10.72,24.43 11.84,25.55 v13.18,25.55
  Bottom 0.152: v21.46,33.83 v13.18,25.55 | v37.57,35.53 37.67,35.43 v37.67,33.55
DB
  Top 0.152: R494.1 20.32,26.17 D401.4
DG
  Top 0.152: R482.1 20.32,27.64 20.34,27.64 D401.3
DR
  Top 0.152: D401.2 23.88,27.7 R470.1
GND  (via drill 0.33)
  other vias: 33.88,15.21 33.88,17.3 43.81,25.96 43.81,21.87 50.62,3.02 51.79,21.16 50.11,7.62 28.17,32.66 32.28,32.51 34.29,25.83 24.46,32.13 24.84,24.43 16.84,22.91 19.25,22.15 21.41,20.62 8.33,28.88 48.74,30.76 51.79,25.17
  pour Bottom (no thermals): 2.54,38.1 58.42,38.1 arc-90 60.96,35.56 60.96,2.54 arc-90 58.42,0 2.54,0 arc-90 0,2.54 0,35.56 arc-90
  pour Top (no thermals): 2.54,38.1 58.42,38.1 arc-90 60.96,35.56 60.96,2.54 arc-90 58.42,0 2.54,0 arc-90 0,2.54 0,35.56 arc-90
IA  (via drill 0.33)
  Top 0.152: v35.15,34.34 34.62,34.87 23.34,34.87 v22.3,33.83 | U401.43 40.36,24.33 40.11,24.59 38.81,24.59 38.1,23.88 37.69,23.88 v36.98,24.59
  Bottom 0.152: v36.98,24.59 35.13,26.44 35.13,34.31 v35.15,34.34 | v22.3,33.83 13.97,25.5 J406.9
IC  (via drill 0.33)
  Top 0.152: v29.36,18.85 U401.32
  Bottom 0.152: v29.36,18.85 29.21,18.69 29.21,17.91 29.18,17.88 29.18,6.38 J406.3
IG  (via drill 0.33)
  Top 0.152: v29.16,19.68 32.17,22.7 32.21,22.73 32.32,22.84 U401.40 | v27.74,15.6 26.31,14.17 v24.71,14.17
  Bottom 0.152: v29.16,19.68 28.04,18.57 28.04,17.27 28.32,16.99 28.32,16.18 v27.74,15.6 | v24.71,14.17 24.13,13.59 J406.5
MISO  (via drill 0.33)
  Top 0.152: v30.1,27.3 29.59,27.81 28.02,27.81 27.56,27.36 26.14,27.36 U401.77 | v30.1,25.25 29.77,24.92 v27.41,24.92 | v26.57,13.01 24.69,11.12 21.29,11.12 v17.75,7.59 | v9.68,4.93 9.93,5.18 15.34,5.18 J406.8
  Bottom 0.152: v30.1,25.25 v30.1,27.3 | v27.41,24.92 26.85,24.36 26.85,13.28 v26.57,13.01 | J406.8 v17.75,7.59 | J402.3 9.68,2.06 v9.68,4.93
MOSI  (via drill 0.33)
  Top 0.152: v22.38,29.67 24.41,29.67 24.87,29.21 26.11,29.21 26.11,27.91 U401.76 | v12.01,3.91 12.62,4.52 v17.93,4.52
  Bottom 0.152: v22.38,29.67 18.47,25.76 18.47,19.58 19.2,18.85 19.2,6.5 J406.7 19,6.3 19,5.59 v17.93,4.52 | J402.2 12.01,1.85 v12.01,3.91
N$1
  Top 0.152: R304.1 47.22,30.73 D301.A
N$2
  Top 0.152: R301.2 44.98,28.63 44.98,25.2 46.81,25.2 47.43,24.58 U301.5
N$4  (via drill 0.33)
  Top 0.152: v45.62,32.92 45.72,32.92 D301.C | U301.1 47.42,26.24 v47.09,25.91
  Bottom 0.152: v45.62,32.92 47.09,31.45 v47.09,25.91
N$6
  Top 0.152: 54.94,34.24 Q050.3 53.85,34.29 53.85,32.69 50.29,32.69 50.29,32 | 49.55,32 D050.A | R031.1 49.64,29.72 50.29,29.72 50.29,32 | 49.4,32 D050.A | 50.29,32 D050.A
N$7
  Top 0.152: R050.1 51.03,30.73 D050.C
N$10
  Top 0.152: Q201.1 50.04,8.59 44.93,13.69 S201.2
N$17
  Top 0.152: C204.1 58.56,6.86 57.18,6.86 U201.4
PWM2  (via drill 0.33)
  Top 0.152: v26.26,30.73 28.27,30.73 28.54,30.47 U401.74 | v33.35,34.29 v25.27,34.29 | v40.64,21.46 v37.85,21.46 | v40.79,3.1 40.77,3.07 v28.09,3.07
  Bottom 0.152: v26.26,30.73 25.3,31.7 25.3,34.27 v25.27,34.29 | v33.35,34.29 33.71,33.93 33.71,25.6 v37.85,21.46 | v40.64,21.46 41.55,20.55 41.55,3.86 v40.79,3.1 | v28.09,3.07 26.67,1.65 J403.5
PWM5  (via drill 0.33)
  Top 0.152: v27.41,28.12 31.01,28.12 31.01,29.74 U401.69 | v18.44,9.4 v23.93,14.88
  Bottom 0.152: v27.41,28.12 25.73,26.44 25.73,17.96 23.93,16.15 v23.93,14.88 | v18.44,9.4 18.64,9.2 18.64,7.62 17.68,6.66 17.68,5.08 17.35,4.75 17.35,2.97 J403.2
PWM6  (via drill 0.33)
  Top 0.152: v13.36,28.3 18.31,33.25 31.22,33.25 31.22,32.33 31.52,32.03 31.52,29.77 U401.68 | v10.26,2.44 15.34,2.44 J403.1
  Bottom 0.152: v13.36,28.3 10.85,25.78 10.85,16.56 11.12,16.28 11.12,7.72 10.26,6.86 v10.26,2.44
PWMB  (via drill 0.33)
  Top 0.152: v20.32,20.55 R494.2 | v20.02,4.27 20.3,3.99 20.68,3.99 22.23,2.44 28.04,2.44 J403.6 | v25.45,29.79 27.94,29.79 27.96,29.77 U401.75
  Bottom 0.152: v20.02,4.27 20.22,4.47 20.22,6.86 20.04,7.04 20.04,20.27 v20.32,20.55 23.16,23.39 23.16,26.57 v25.22,28.63 25.22,29.57 v25.45,29.79
PWMG  (via drill 0.33)
  Top 0.152: R482.2 | U401.73 29.03,29.77 29.03,30.63 28.35,31.32 21.41,31.32 20.46,30.37 R482.2 | J403.3 20.5,2.36 20.5,3.68 13.11,3.68 v12.85,3.94 | v12.8,22.68 17.88,27.76 18.01,27.76 19.63,29.39 19.63,30.33 20.27,30.33 R482.2
  Bottom 0.152: v12.85,3.94 12.8,3.99 v12.8,22.68
PWMR  (via drill 0.33)
  Top 0.152: v25.43,30.63 24.13,30.63 R470.2 | v27.1,28.96 27.3,28.75 30.28,28.75 30.53,29.01 U401.70 | v20.62,7.42 20.62,7.06 20.42,6.86 20.42,5.11 21.92,5.11 v22.45,4.57
  Bottom 0.152: v25.43,30.63 v27.1,28.96 25.43,27.28 25.43,21.67 20.62,16.87 v20.62,7.42 | v22.45,4.57 24.13,2.9 J403.4
RAW
  Top 0.152: U201.3 54.29,6.67 54.1,6.86 53.45,6.86 C201.1 53.34,7.62 Q201.3 | U201.3 54.61,6.64 54.61,6.6 | U201.1 55.37,8.56 55.37,6.73 54.61,6.73 U201.3
RD  (via drill 0.33)
  Top 0.152: U401.46 37.53,25.84 v37.44,25.76
  Bottom 0.152: v37.44,25.76 36.25,25.76 36.25,28.19 36.32,28.27 36.32,35.18 34.67,36.83 J401.2
RGB_Q
  Top 0.152: S401.1 22.55,26.17 D401.1
RST  (via drill 0.33)
  Top 0.152: v22.45,16.05 22.55,16.05 22.55,16.97 R401.5 | v22.96,5.49 24.18,4.27 v38.25,4.27 | v38.73,15.21 38.12,15.82 36.85,15.82 36.04,15.01 U401.17 | v39.14,7.85 39.77,7.85 S417.P$2
  Bottom 0.152: v22.45,16.05 22.17,15.77 22.17,7.44 22.96,6.66 v22.96,5.49 | v38.25,4.27 39.14,5.16 v39.14,7.85 39.09,7.9 39.09,14.86 v38.73,15.21
RXD0  (via drill 0.33)
  Top 0.152: v29.79,16.76 29.21,16.18 27.51,16.18 27.34,16.34 U401.99
  Bottom 0.152: v29.79,16.76 29.95,16.92 29.95,22.78 29.21,23.52 J401.4
RXD1  (via drill 0.33)
  Top 0.152: U401.63 34.04,28.47 v32.82,28.47 | v32.82,22.15 34.34,20.62 v40.66,20.62 | v40.21,2.49 40.26,2.44 53.44,2.44 J404.6
  Bottom 0.152: v32.82,22.15 v32.82,28.47 | v40.66,20.62 41.25,20.04 41.25,14.45 40.21,13.41 v40.21,2.49
SCK  (via drill 0.33)
  Top 0.152: v26.57,12.17 25.22,10.82 22.53,10.82 21.59,9.88 J406.6 | 26.14,26.82 U401.78 27.28,26.84 v27.41,26.72 | J402.4 8.18,3.1 v19.91,3.1
  Bottom 0.152: v27.41,26.72 27.99,26.14 27.99,22.38 27.15,21.54 27.15,12.75 v26.57,12.17 | v19.91,3.1 21.59,4.78 J406.6
SCL  (via drill 0.33)
  Top 0.152: v25.3,5.49 25.6,5.18 30.58,5.18 J406.2 | R401.6 22.86,17.53 24.33,16.05 v24.64,16.05 | U401.24 39.52,13.95 39.52,16.2 39.27,16.46 v39.09,16.46 35.26,16.46 35,16.2 v31.75,16.2 | J002.1 40.64,35.56 v38.61,35.56
  Bottom 0.152: v24.64,16.05 25.3,15.39 v25.3,5.49 | J406.2 v31.75,16.2 | v38.61,35.56 39.09,35.08 39.09,28.32 38.81,28.04 38.81,27.48 38.86,27.43 38.86,25.4 39.12,25.15 39.12,18.03 39.09,18.03 v39.09,16.46
SDA  (via drill 0.33)
  Top 0.152: v22.76,10.24 25.09,7.9 34.72,7.9 34.92,8.1 35.38,8.1 35.74,7.75 35.74,6.35 | J406.1 35.74,6.35 | R401.8 22.58,18.59 23.16,18.59 v23.34,18.77 | v40.79,5.79 40.69,5.69 36.4,5.69 35.74,6.35 | U401.25 40.11,13.92 v40.82,13.21 40.87,13.26 40.95,13.26 v42.44,14.76
  Bottom 0.152: v23.34,18.77 22.76,18.19 22.76,16.56 23.04,16.28 23.04,10.52 v22.76,10.24 | v40.82,13.21 40.79,13.18 v40.79,5.79 | J002.2 42.19,34.01 42.19,15.01 v42.44,14.76
TD  (via drill 0.33)
  Top 0.152: v36.83,26.34 U401.47
  Bottom 0.152: J401.1 v36.83,26.34
TXD0  (via drill 0.33)
  Top 0.152: v30,23.57 v27.74,21.31 | U401.98 27.66,16.84 v27.74,16.76
  Bottom 0.152: v27.74,21.31 v27.74,16.76 | v30,23.57 29.52,24.05 29.52,34.59 J401.3
TXD1  (via drill 0.33)
  Top 0.152: v47.12,34.14 37.44,34.14 36.42,33.12 31.7,33.12 31.7,32.28 32.38,31.6 33.68,31.6 34.52,30.76 34.52,29.77 U401.62
  Bottom 0.152: v47.12,34.14 48.08,33.17 48.08,26.09 51.21,22.96 51.21,2.13 J404.5
USB_ON  (via drill 0.33)
  Top 0.152: v47.75,22.86 48.62,22.86 R010.1 | v37.9,15.24 38.02,15.24 38.02,13.95 U401.21 | v40.66,15.77 41.1,15.34 45.72,15.34 v47.37,16.99 | v47.68,19.1 48.59,19.1 S010.P$1
  Bottom 0.152: v47.75,22.86 47.68,22.78 v47.68,19.1 47.62,19.05 47.62,17.25 v47.37,16.99 | v37.9,15.24 37.9,15.54 38.23,15.88 40.56,15.88 v40.66,15.77
USB_SOFTCONNECT  (via drill 0.33)
  Top 0.152: R051.2 | Q050.1 52.83,35.23 52.78,35.18 51.8,35.18 arc90 R051.2 | v35.74,34.95 51.51,34.95 R051.2 | U401.64 33.53,29.77 33.53,31.01 v32.16,31.01
  Bottom 0.152: v35.74,34.95 34.59,34.95 34.59,35 34.42,35.18 31.7,35.18 31.7,31.47 v32.16,31.01
USBD+  (via drill 0.33)
  Top 0.152: C030.1 49.66,28.19 49.66,26.92 R030.1 49.61,26.87 48.06,25.32 v48.06,25.3 | v42.77,33.5 42.75,33.53 v38.51,33.53 | v38.51,17.96 40.21,17.96 40.82,17.35 U401.29
  Bottom 0.152: v48.06,25.3 47.68,25.68 47.68,31.67 45.85,33.5 v42.77,33.5 | v38.51,33.53 38.51,25.25 38.61,25.15 38.61,18.06 v38.51,17.96
USBD-  (via drill 0.33)
  Top 0.152: C020.1 49.66,25.65 49.66,24.38 R020.1 49.61,24.33 v48.79,23.52 | U401.30 42.86,17.84 43.18,17.53 44.32,17.53 44.73,17.93 v48.92,17.93
  Bottom 0.152: v48.79,23.52 48.92,23.39 v48.92,17.93
VBUS  (via drill 0.33)
  Top 0.152: J001.VBUS 53.87,24.05 51.89,24.05 51,23.16 R011.2 50.95,23.11 50.95,21.84 R010.2 50.88,21.82 50.22,21.16 48.82,21.16 47.7,22.28 45.54,22.28 | 45.54,21.34 D303.1 | v43.71,30.38 43.71,30.91 44.12,31.32 45.24,31.32 R304.2 | 45.54,22.28 45.54,24.28 U301.4 45.52,24.36 45.39,24.36 45.39,24.59 45.34,24.64 44.4,24.64 v44.4,25.35 | 45.54,22.28 45.54,21.41 D303.1 | v45.31,3.89 45.31,5.87 v45.24,5.87 | C302.1 46.48,20.07 46.48,21.08 45.8,21.08 arc-90 D303.1
  Bottom 0.152: v43.71,30.38 44.4,29.69 v44.4,25.35 44.17,25.12 44.17,22.55 44.4,22.33 44.4,21.64 43.26,20.5 43.26,7.85 v45.24,5.87 | J404.2 45.31,2.13 v45.31,3.89
VCC  (via drill 0.33)
  Top 0.152: C410.1 32.54,12.61 U401.10 | C412.1 33.54,12.54 U401.12 | U401.13 34.04,12.69 arc90 C413.1 | U401.19 37.04,12.95 36.69,12.95 C419.1 36.02,12.37 34.44,12.37 C413.1 | C205.1 59.94,7.62 57.15,7.62 | 57.15,7.62 57.15,8.57 U201.5 | 43.65,16.83 arc32 43.61,16.84 U401.28 41.88,16.79 v40.66,16.79 40.62,16.79 40.13,17.27 34.67,17.27 34.11,16.71 32.05,16.71 31.98,16.79 31.17,16.79 v30.58,16.2 | 43.65,16.83 arc-58 43.69,16.76 | 42.93,23.84 U401.42 41.88,23.88 v40.01,23.88 | 42.93,23.84 43.69,23.84 C442.1 | U401.71 30.04,30.91 C471.1 30.63,31.55 v30.63,32.46 | U401.84 24.61,23.84 23.99,23.23 C484.1 23.82,23.19 23.65,23.01 22.12,23.01 | 5.79,26.62 6.86,26.62 J701.4 6.93,26.57 12.98,26.57 13.77,25.78 13.77,24.46 10.85,21.54 10.85,19.63 12.45,18.03 18.03,18.03 | J406.11 5.79,9.45 5.79,26.62 | J401.6 23.14,35.84 19.43,35.84 16.87,33.27 C701.1 7.11,33.27 7.11,32.64 5.79,31.32 5.79,26.62 | S401.2 21.67,23.88 21.67,23.16 21.82,23.01 22.12,23.01 | R401.4 21.64,16.99 21.64,17.53 R401.3 21.64,17.6 21.64,18.01 R401.2 | R401.1 21.64,18.57 21.64,18.09 R401.2 | 24.38,18.41 C496.1 | 24.36,18.57 24.36,18.49 C496.1 | 21.72,18.57 R401.1 | 18.03,18.03 18.03,18.85 19.15,19.96 22.07,19.96 22.07,22.96 22.12,23.01 | 18.03,18.03 21.57,18.03 R401.2 | C428.1 43.65,16.83 | v30.07,9.5 29.23,9.5 28.7,8.97 U402.1 | v30.94,10.67 31.57,11.3 31.57,12.29 32.21,12.29 C410.1 | C412.1 33.27,12.37 32.29,12.37 C410.1 | 30.45,17.75 v30.63,17.93 30.35,17.65 27.56,17.65 27.38,17.83 26.21,17.83 U401.96 26.11,17.86 24.38,17.86 C496.1 | C103.1 C103.1 arc90 48.66,8.38 47.73,8.38 47.55,8.56 U101.3 | 47.47,8.53 U101.3 | C454.1 38.99,31.5 38.53,31.04 38.53,29.77 U401.54 38.53,29.67 38.53,27.81 v39.4,27.81
  Top 0.152: Q050.2 52.83,33.35 52.55,33.63 R051.1 51.51,33.58 51.44,33.5 43.59,33.5 42.75,32.66 42.42,32.66 42.29,32.54 42.29,28.35 42.77,28.35 42.93,28.19 42.93,23.84 | 43.74,23.8 C442.1 | C413.1 C412.1 | R401.1 21.62,19.36 23.95,19.36 24.38,18.92 C496.1 | U101.3 46.54,8.57 46.23,8.26 v46.23,7.62 45.82,7.21 45.82,5.56 46.18,5.21 46.63,5.21 46.91,5.49 54.59,5.49 56.72,7.62 57.15,7.62 | v44.76,22.78 44.76,24.02 C442.1
  Bottom 0.152: v30.07,9.5 30.94,10.36 v30.94,10.67 30.58,11.02 v30.58,16.2 30.68,16.31 30.68,17.93 | v30.63,32.46 30.68,32.41 30.68,17.93 | v30.63,17.93 30.68,17.93 | J404.3 46.99,7.62 v46.23,7.62 46.23,8.69 44.76,10.16 v44.76,22.78 | v39.4,27.81 40.01,27.2 v40.01,23.88 40.06,23.82 40.06,20.42 40.26,20.22 40.26,18.03 40.66,17.63 v40.66,16.79
VIN+  (via drill 0.33)
  Top 0.152: R103.1 43.69,7.62 U101.5 44.98,7.67 45.21,7.67 v47.6,10.06 | v48.23,24.16 48.23,23.98 47.83,23.57 46.58,23.57 46.48,23.47 D303.3
  Bottom 0.152: v48.23,24.16 48.21,24.13 48.21,23.22 48.34,23.09 48.34,16.15 48.64,15.85 48.64,11.1 v47.6,10.06
VIN-  (via drill 0.33)
  Top 0.152: R102.2 41.15,9.12 v43.92,9.12 43.92,8.5 R103.2 arc-90 43.8,8.38 44.45,8.38 arc-90 44.64,8.57 U101.4 | v46.41,5.79 49.17,5.79 50.04,6.66 Q201.2 | 44.91,16.46 S201.3 44.59,16.13 44.45,16.13 44.25,15.93 v43.84,15.93
  Bottom 0.152: J404.1 41.91,1.29 v46.41,5.79 44.45,7.75 44.45,9.12 | v43.84,15.93 44.45,15.32 44.45,9.12 | 44.45,9.12 v43.92,9.12
VLIPO  (via drill 0.33)
  Top 0.152: v46.53,21.69 47.09,21.69 47.42,21.36 D303.2 | v46.25,25.91 45.54,26.62 45.54,26.95 U301.3 45.59,27 45.59,27.3 45.72,27.43 45.72,28.08 C303.1 | v46.74,14.91 48.67,12.98 J301.2
  Bottom 0.152: v46.25,25.91 46.25,21.97 v46.53,21.69 46.74,21.49 v46.74,14.91
XTAL1
  Top 0.152: C422.2 37.06,9.91 Y401.3 38.54,10.36 U401.22
XTAL2
  Top 0.152: C423.2 40.05,12.33 arc90 Y401.1 39.24,12.45 39.12,12.45 39.04,12.53 U401.23

### Text on the board
tPlace: VCC | GND | RX0 | TX0 | RD | TD | SDA | SCL | CHARGE | USB | STOP | BOOT | ON | RESET | GND | 11DoF | SCK | MISO | MOSI | CS | P6 | P5 | PG | PR | P2 | PB | AR | AD2 | AD1 | STOP | VBAT | VBUS | VCC | GND | TX1 | RX1
bPlace: VCC | GND | RX0 | TX0 | RD | TD | SDA | SCL | St Kwan's Home for | Project Candace | the Terminally ADD | Loginator2368 | a division of Kwan Systems | stkwans.blogspot.com | 13 Apr 2012 | GND | VCC | CSA | IA | MISO | MOSI | SCK | IG | CSG | CI | SCL | SDA | 11DoF | SCK | MISO | MOSI | CS | P6 | P5 | PG | PR | P2 | PB | AR | AD2 | AD1 | STOP | VBAT | VBUS | VCC | GND | TX1 | RX1
Document: Released under the Creative Commons Attribution Share-Alike 3.0 License | http://creativecommons.org/licenses/by-sa/3.0 | Original design by C. Taylor and N. Seidle, Sparkfun Electronics http://www.sparkfun.com/products/10216 | Heavily modified by C. Jeppesen, St Kwan's Home for the Terminally ADD, stkwans.blogspot.com